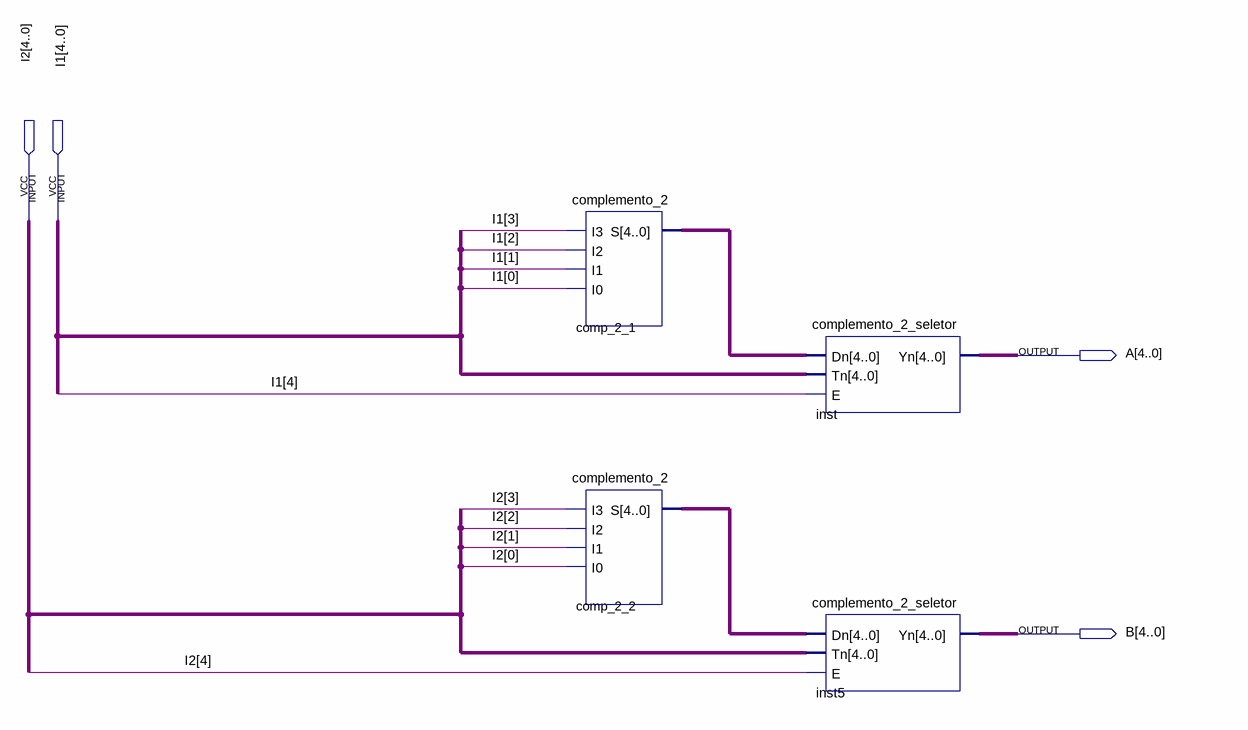
[diagram p0: schematic sheet]
// Quartus schematic complemento_2_checagem.bdf as structural Verilog: 4 symbols, 4 pins
module complemento_2_checagem (
  input  [4:0] I2,
  input  [4:0] I1,
  output [4:0] A,
  output [4:0] B
);

  wire [4:0] comp_2_1_s, comp_2_2_s;

  complemento_2 comp_2_1 (.I3(I1[3]), .I2(I1[2]), .I1(I1[1]), .I0(I1[0]), .S(comp_2_1_s));
  complemento_2 comp_2_2 (.I3(I2[3]), .I2(I2[2]), .I1(I2[1]), .I0(I2[0]), .S(comp_2_2_s));
  complemento_2_seletor inst (.Dn(comp_2_1_s), .Tn(I1), .E(I1[4]), .Yn(A));
  complemento_2_seletor inst5 (.Dn(comp_2_2_s), .Tn(I2), .E(I2[4]), .Yn(B));
endmodule
